# EAGLE schematic power (EAGLE 9.6.0)
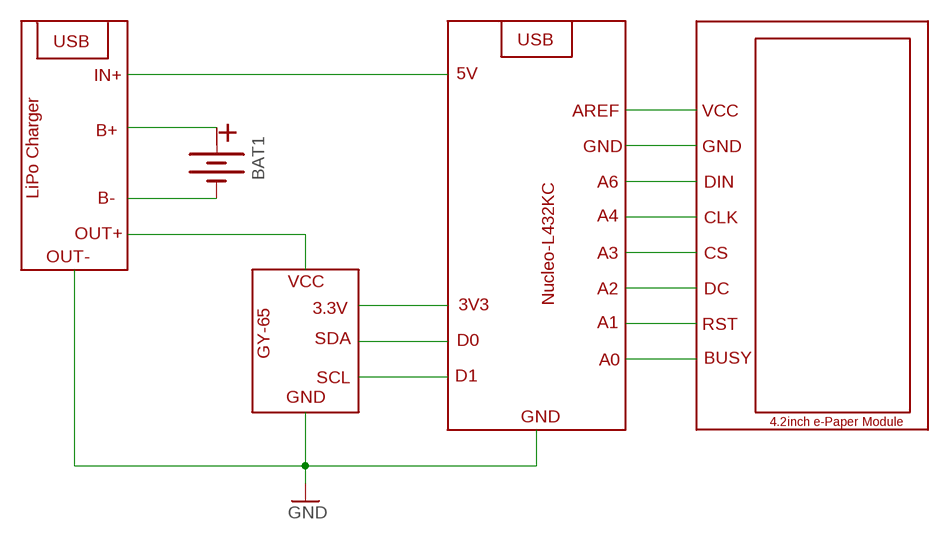
[diagram p0: schematic, sheet 1]

## Parts
BAT1  BATTERY  [BATTERY]

## Nets
N$1: BAT1.+
N$2: BAT1.-

## Notes on the sheet
- USB | USB
- IN+ | 5V
- AREF | VCC
- B+
- +
- GND | GND
- A6 | DIN
- LiPo Charger
- B-
- A4 | CLK
- OUT+
- OUT- | A3 | CS
- VCC
- A2 | DC
- Nucleo-L432KC
- 3.3V | 3V3
- A1 | RST
- SDA | D0
- GY-65
- A0 | BUSY
- SCL | D1
- GND
- GND | 4.2inch e-Paper Module

## Power pins joined to a net without a drawn wire
+: BAT1.+@1(+)

## Library data of the parts
BAT1 = special:BATTERY: BATTERY